# EAGLE schematic modbusbox (EAGLE 9.4.2)
COMPANY: ADAFRUIT INDUSTRIES; DRAWN: KTOWN; REV: B
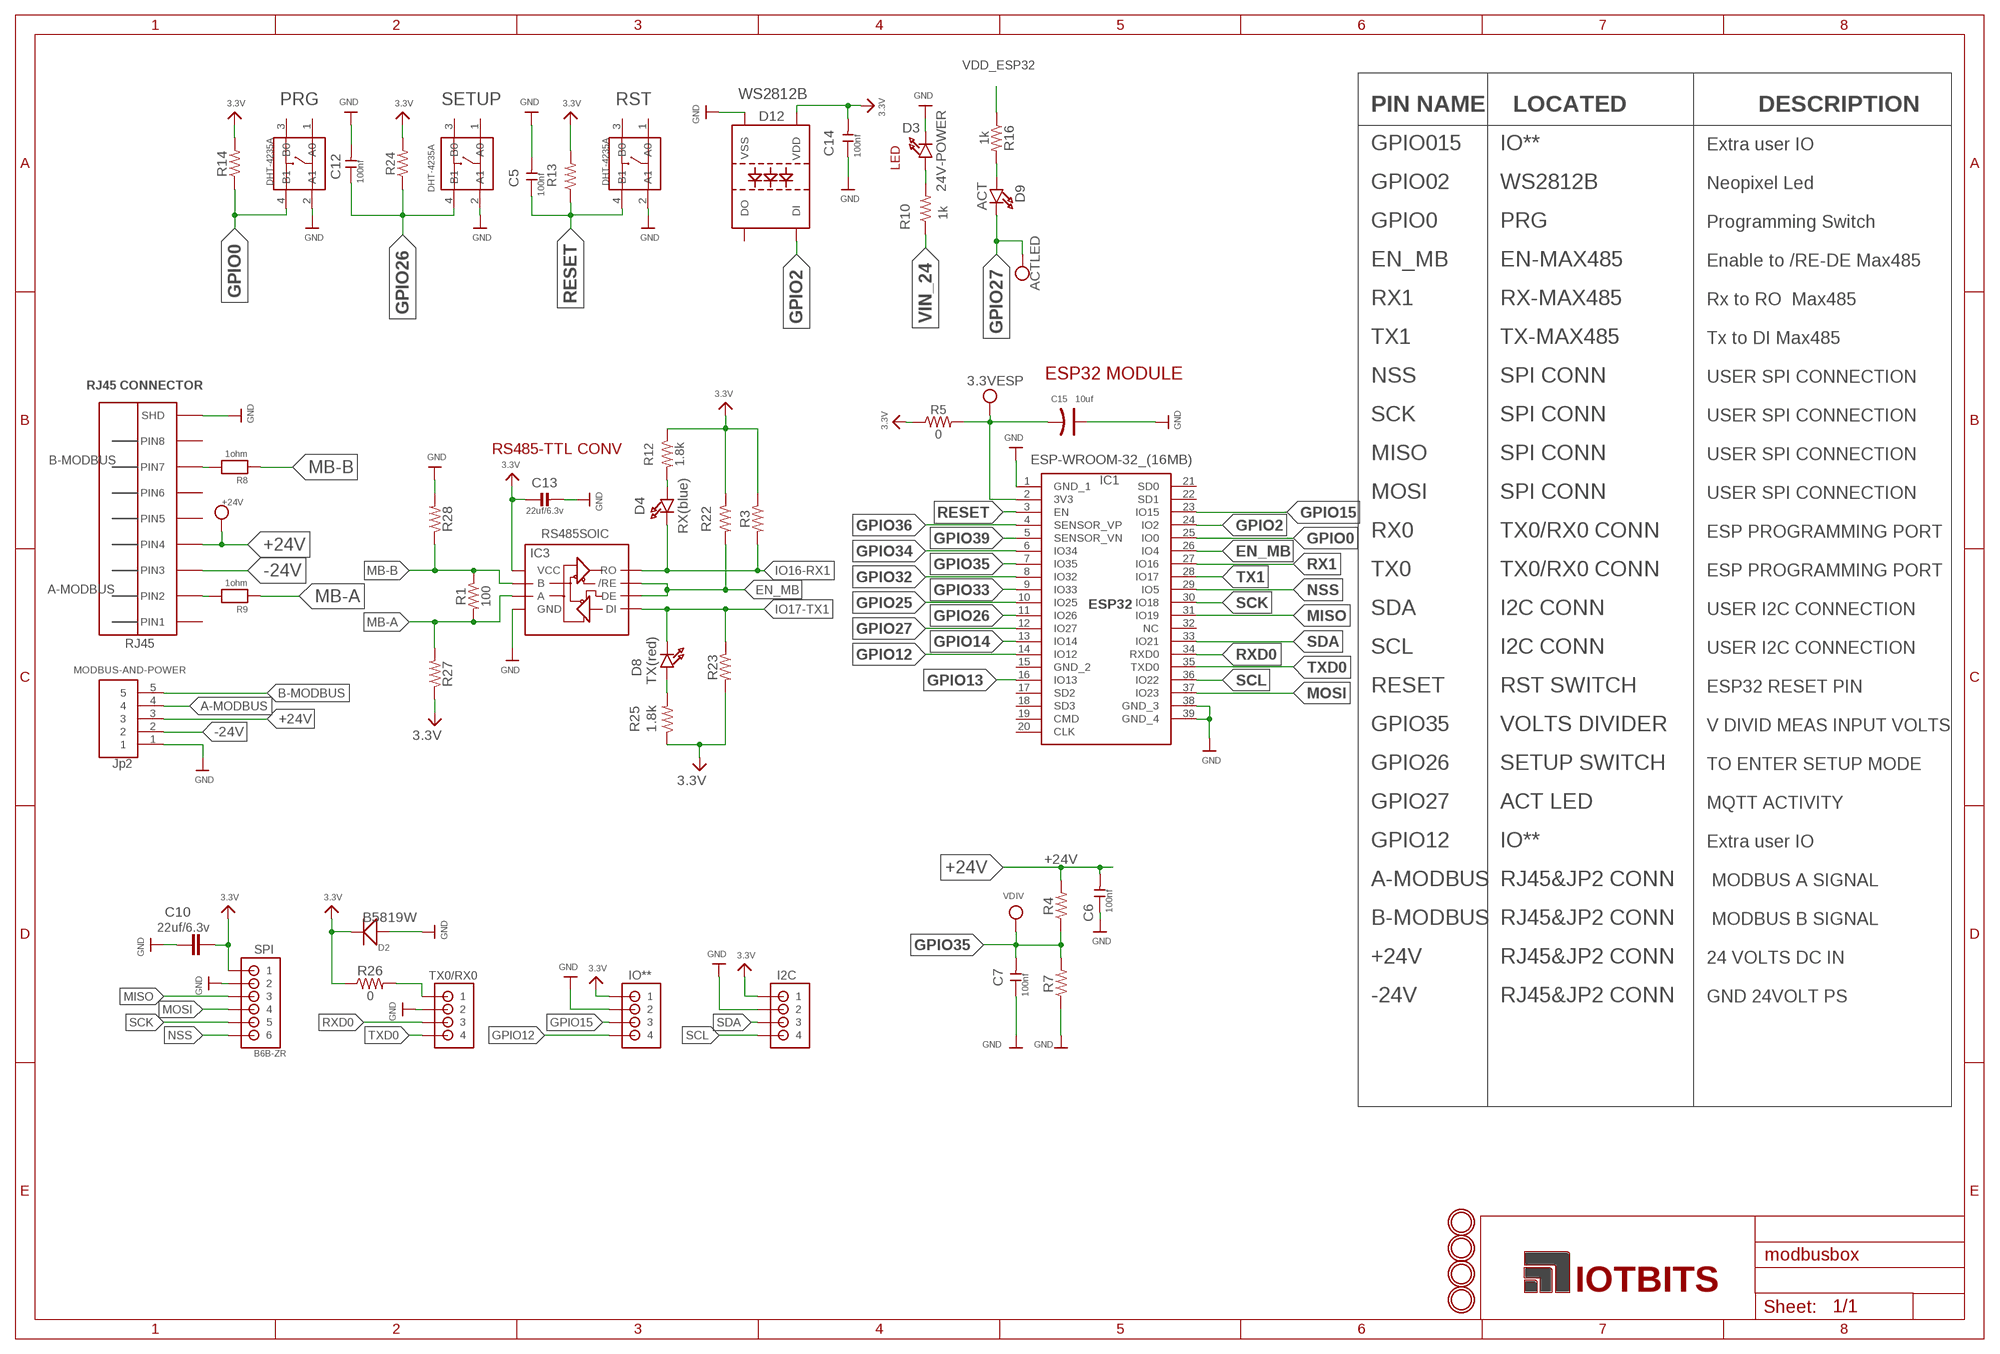
[diagram p0: schematic, sheet 1]

## Parts
3.3VESP  TESTPOINTROUND2MM  [TESTPOINT_ROUND_2MM]
+24V  TESTPOINTROUND2MM  [TESTPOINT_ROUND_2MM]
ACTLED  TESTPOINTROUND2MM  [TESTPOINT_ROUND_2MM]
C5  100nf  CERAMIC-100NF-50V-10%-X7R(0603)  [C0603]
C6  100nf  CERAMIC-100NF-50V-10%-X7R(0603)  [C0603]
C7  100nf  CERAMIC-100NF-50V-10%-X7R(0603)  [C0603]
C10  22uf/6.3v  CAP0805-CAP-LARGEPADS  [0805-CAP-LARGEPADS]
C12  100nf  CERAMIC-100NF-50V-10%-X7R(0603)  [C0603]
C13  22uf/6.3v  CAP_CERAMIC_0805  [_0805]
C14  100nf  CERAMIC-100NF-50V-10%-X7R(0603)  [C0603]
C15  10uf  TANTALUM-SMD-10UF-10V-10%(AVX-A)  [AVX-A]
D2  B5819W  SMD-DIODE-SCHOTTKY-20V-1A(SOD-123)  [SOD-123]
D3  24V-POWER  LED0603  [CHIPLED_0603]
D4  RX(blue)  LED0603  [CHIPLED_0603]
D8  TX(red)  LED0603  [CHIPLED_0603]
D9  ACT  LED0603  [CHIPLED_0603]
D12  WS2812B  [WS2812B]
I2C  B4B-ZR  [B4B-ZR]
IC1  ESP-WROOM-32_(16MB)  [ESP32WROOM32D]
IC3  RS485SOIC  [SO08]
IO**  B4B-ZR  [B4B-ZR]
MODBUS-AND-POWER  5PIN  [B5B-PH-K-S]
PRG  DHT-4235A  SMD-BUTTON-TOP-DHT-4235A(4P-4.2X3.2MM)  [SW4-SMD-4.2X3.2X2.5MM]
R1  100  100OHM-0603-1/4W-5%  [0603]
R3  10KOHM-0603-1/10W-1%  [0603]
R4  100k  10KOHM-0603-1/10W-1%  [0603]
R5  0  0OHM-0603-1/10W-5%  [0603]
R7  15k  10KOHM-0603-1/10W-1%  [0603]
R8  1ohm  RESISTOR0603  [0603]
R9  1ohm  RESISTOR0603  [0603]
R10  1k  1KOHM-0603-1/10W-1%  [0603]
R12  1.8k  1.8KOHM-0603-1/10W-1%  [0603]
R13  10KOHM-0603-1/10W-1%  [0603]
R14  10KOHM-0603-1/10W-1%  [0603]
R16  1k  1KOHM-0603-1/10W-1%  [0603]
R22  10KOHM-0603-1/10W-1%  [0603]
R23  10KOHM-0603-1/10W-1%  [0603]
R24  10KOHM-0603-1/10W-1%  [0603]
R25  1.8k  1.8KOHM-0603-1/10W-1%  [0603]
R26  0  0OHM-0603-1/10W-5%  [0603]
R27  2.2k  10KOHM-0603-1/10W-1%  [0603]
R28  2.2k  10KOHM-0603-1/10W-1%  [0603]
RJ45  RJ45 CONNECTOR  RJ45  [RJ45]
RST  DHT-4235A  SMD-BUTTON-TOP-DHT-4235A(4P-4.2X3.2MM)  [SW4-SMD-4.2X3.2X2.5MM]
SETUP  DHT-4235A  SMD-BUTTON-TOP-DHT-4235A(4P-4.2X3.2MM)  [SW4-SMD-4.2X3.2X2.5MM]
SPI  B6B-ZR  [B6B-ZR]
TX0/RX0  B4B-ZR  [B4B-ZR]
U$30  MOUNTINGHOLE3.0THIN  [MOUNTINGHOLE_3.0_PLATEDTHIN]
U$31  MOUNTINGHOLE3.0THIN  [MOUNTINGHOLE_3.0_PLATEDTHIN]
U$33  MOUNTINGHOLE3.0THIN  [MOUNTINGHOLE_3.0_PLATEDTHIN]
U$35  MOUNTINGHOLE3.0THIN  [MOUNTINGHOLE_3.0_PLATEDTHIN]
VDIV  TESTPOINTROUND2MM  [TESTPOINT_ROUND_2MM]

## Nets
3.3V [32mil]: C10.1 C13.1 C14.2 D2.- D12.1(VDD) I2C.1 IC3.8(VCC) IO**.1 R3.1 R5.1 R12.1 R13.2 R14.2 R22.1 R23.2 R24.2 R25.1 R26.1 R27.1 SPI.1
+24V: +24V.P$1 C6.2 MODBUS-AND-POWER.3 R4.2 RJ45.P$10(PIN4)
-24V: MODBUS-AND-POWER.2 RJ45.P$9(PIN3)
A-MODBUS [12mil]: MODBUS-AND-POWER.4 R9.2 RJ45.P$3(PIN2)
B-MODBUS [12mil]: MODBUS-AND-POWER.5 R8.2 RJ45.P$6(PIN7)
EN_MB: IC1.26(IO4) IC3.2(/RE) IC3.3(DE) R22.2
GND [18mil]: C5.2 C6.1 C7.1 C10.2 C12.2 C13.2 C14.1 C15.+ D2.+ D3.C D12.3(VSS) I2C.2 IC1.1(GND_1) IC1.38(GND_3) IC1.39(GND_4) IC3.5(GND) IO**.2 MODBUS-AND-POWER.1 PRG.2(A1) R7.1 R28.2 RJ45.P$1(SHD) RJ45.P$2(SHD) RST.2(A1) SETUP.2(A1) SPI.2 TX0/RX0.2
GPIO0: IC1.25(IO0) PRG.4(B1) R14.1
GPIO2: D12.4(DI) IC1.24(IO2)
GPIO12: IC1.14(IO12) IO**.4
GPIO13: IC1.16(IO13)
GPIO14: IC1.13(IO14)
GPIO15: IC1.23(IO15) IO**.3
GPIO25: IC1.10(IO25)
GPIO26: C12.1 IC1.11(IO26) R24.1 SETUP.4(B1)
GPIO27: ACTLED.P$1 D9.C IC1.12(IO27)
GPIO32: IC1.8(IO32)
GPIO33: IC1.9(IO33)
GPIO34: IC1.6(IO34)
GPIO35: C7.2 IC1.7(IO35) R4.1 R7.2 VDIV.P$1
GPIO36: IC1.4(SENSOR_VP)
GPIO39: IC1.5(SENSOR_VN)
IO16-RX1: D4.C IC3.1(RO) R3.2
IO17-TX1: D8.C IC3.4(DI) R23.1
MB-A [12mil]: IC3.6(A) R1.2 R9.1 R27.2
MB-B [12mil]: IC3.7(B) R1.1 R8.1 R28.1
MISO: IC1.31(IO19) SPI.3
MOSI: IC1.37(IO23) SPI.4
N$5: D3.A R10.2
N$8: D8.A R25.2
N$14: D9.A R16.2
N$15 [20mil]: R26.2 TX0/RX0.1
N$17: D4.A R12.2
NSS: IC1.29(IO5) SPI.6
RESET: C5.1 IC1.3(EN) R13.1 RST.4(B1)
RX1: IC1.27(IO16)
RXD0: IC1.34(RXD0) TX0/RX0.3
SCK: IC1.30(IO18) SPI.5
SCL: I2C.4 IC1.36(IO22)
SDA: I2C.3 IC1.33(IO21)
TX1: IC1.28(IO17)
TXD0: IC1.35(TXD0) TX0/RX0.4
VDD_ESP32 [32mil]: 3.3VESP.P$1 C15.- IC1.2(3V3) R5.2 R16.1
VIN_24 [14mil]: R10.1
Unconnected: D12.2(DO) IC1.15(GND_2) IC1.17(SD2) IC1.18(SD3) IC1.19(CMD) IC1.20(CLK) IC1.21(SD0) IC1.22(SD1) IC1.32(NC) PRG.1(A0) PRG.3(B0) RJ45.P$4(PIN8) RJ45.P$5(PIN6) RJ45.P$7(PIN5) RJ45.P$8(PIN1) RST.1(A0) RST.3(B0) SETUP.1(A0) SETUP.3(B0)

## Notes on the sheet
- PIN NAME | LOCATED | DESCRIPTION
- GPIO015 | IO** | Extra user IO
- LED
- GPIO02 | WS2812B | Neopixel Led
- GPIO0 | PRG | Programming Switch
- EN_MB | EN-MAX485 | Enable to /RE-DE Max485
- RX1 | RX-MAX485 | Rx to RO  Max485
- TX1 | TX-MAX485 | Tx to DI Max485
- ESP32 MODULE | NSS | SPI CONN | USER SPI CONNECTION
- RJ45 CONNECTOR
- SCK | SPI CONN | USER SPI CONNECTION
- RS485-TTL CONV
- MISO | SPI CONN | USER SPI CONNECTION
- MOSI | SPI CONN | USER SPI CONNECTION
- RX0 | TX0/RX0 CONN | ESP PROGRAMMING PORT
- TX0 | TX0/RX0 CONN | ESP PROGRAMMING PORT
- ESP32
- SDA | I2C CONN | USER I2C CONNECTION
- SCL | I2C CONN | USER I2C CONNECTION
- RESET | RST SWITCH | ESP32 RESET PIN
- GPIO35 | VOLTS DIVIDER | V DIVID MEAS INPUT VOLTS
- Jp2 | GPIO26 | SETUP SWITCH | TO ENTER SETUP MODE
- GPIO27 | ACT LED | MQTT ACTIVITY
- GPIO12 | IO** | Extra user IO
- A-MODBUS | RJ45&JP2 CONN | MODBUS A SIGNAL
- B-MODBUS | RJ45&JP2 CONN | MODBUS B SIGNAL
- +24V | RJ45&JP2 CONN | 24 VOLTS DC IN
- -24V | RJ45&JP2 CONN | GND 24VOLT PS

## Library data of the parts
3.3VESP +24V ACTLED VDIV = microbuilder:TESTPOINT: Test Point Various test points for characterisation and PCB testing TESTPOINT_SMT - Compact Surface Mount Test Point [Digikey: 5016KTR-ND]
C5 C12 = Seeed-Capacitor:CERAMIC-100NF-50V-10%-X7R(0603): 302010138; MPN: CC0603KRX7R9BB104; SPICEPREFIX: C
C6 C7 C14 = Seeed-Capacitor:CERAMIC-100NF-50V-10%-X7R(0603): 302010138; MPN: CC0603KRX7R9BB104
C10 = LoLin32-Lora:CAP: Capacitor Standard 0603 ceramic capacitor, and 0.1" leaded capacitor.
C13 = Adafruit HUZZAH32 ESP32 Feather:CAP_CERAMIC: Ceramic Capacitors For new designs, use the packages preceded by an '_' character since they are more reliable: The following footprints should be used on most boards: _0402 - Standard footprint for regular board layouts _0603 - Standard footprint for regular board layouts _0805 - Standard footprint for regular board layouts _1206 - Standard footprint for regular board layouts For extremely tight-pitch boards where space is at a premium, the following 'micro-pitch' footprints can be used (smaller pads, no silkscreen outline, etc.): _0402MP - Micro-pitch footprint for very dense/compact boards _0603MP - Micro-pitch footprint for very dense/compact boards _0805MP - Micro-pitch footprint for very dense/compact boards _1206MP - Micro-pitch footprint for very dense/compact boards
C15 = Seeed-Capacitor:TANTALUM-SMD-10UF-10V-10%(AVX-A): 302020011; MPN: TAJA106K010RNJ
D2 = Seeed-Diode:SMD-DIODE-SCHOTTKY-20V-1A(SOD-123): 304020034; MPN: B5819W; VALUE: 20V-1A; WEB: https://www.mouser.com/datasheet/2/258/B5817W-B5819W(SOD-123)-276623.pdf
D3 D4 D8 D9 = microbuilder:LED: LED 0603 - 0603 Surface Mount Package 2mA: Green LED - Low Power (3.9mcd, 2ma, 1.7Vf) - Digikey: 475-2709-2-ND Orange LED - Low Power (9.8mcd, 2ma, 1.8Vf) - Digikey: 475-1194-2-ND Red LED - Low Power (5mcd, 2ma, 1.8Vf) - Digikey: 475-1195-2-ND Yellow LED - Low Power (7mcd, 2ma, 1.8Vf) - Digikey: 475-1196-2-ND 5mA: Blue LED - Low Power (17mcd, 5ma, 2.9Vf) - Digikey: LNJ937W8CRACT-ND 0805 - 0805 Surface Mount Package 2mA: Red LED (8.8mcd, 2mA, 1.8Vf, Clear) - Low Power [Digikey: 475-2510-1-ND] Green LED (5mcd, 2mA, 1.8Vf, Clear) - Low Power [Digikey: 475-2730-1-ND] Yellow LED (11.3mcd, 2mA, 1.8Vf, Clear) - Low Power [Digikey: 475-2555-1-ND] 20mA: Red LED (104mcd, 20mA, Diffused) - LS R976 [Digikey: 475-1278-6-ND] Red LED (12mcd, 20mA, 2.0Vf, Clear) - APT2012EC [Digikey: 754-1128-1-ND] Green LED (15mcd, 20mA, 2.2Vf, Clear) - APT2012GC [Digikey: 754-1131-1-ND] Orange LED (160mcd, 20mA, 2.1Vf, Clear) - APT2012SECK [Digikey: 754-1130-1-ND] 1206 - 1206 Surface Mount Package Green LED (26mcd, 20mA, Diffused) - LG N971 [Digikey: 475-1407-6-ND] Red LED (15mcd, 20mA, Diffused) - LH N974 [Digikey: 475-1416-6-ND]
D12 = WS2812:WS2812B
I2C IO** TX0/RX0 = jst:B4B-ZR: JST-ZH Connector 4 pol, 1.5mm pitch Package: B4B-ZR Source: http://www.jst-mfg.com/product/pdf/eng/eZH.pdf
IC1 = SamacSys_Parts:ESP-WROOM-32_(16MB): WiFi Modules (802.11) SMD Module, ESP32-D0WDQ6, 128Mbits SPI flash, UART Mode Source: Datasheet <https://www.mouser.com/datasheet/2/891/esp-wroom-32_datasheet_en-1365813.pdf>; DESCRIPTION: WiFi Modules (802.11) SMD Module, ESP32-D0WDQ6, 128Mbits SPI flash, UART Mode; HEIGHT: 3.1mm; MANUFACTURER_NAME: Espressif; MANUFACTURER_PART_NUMBER: ESP-WROOM-32 (16MB); MOUSER_PART_NUMBER: 356-ESPWROOM3216MB; RS_PART_NUMBER: 356-ESPWROOM3216MB
IC3 = RS485_Breakout_v10:RS485
MODBUS-AND-POWER = jst_eph:5PIN
PRG RST = Seeed-Switch:SMD-BUTTON-TOP-DHT-4235A(4P-4.2X3.2MM): 311020045; MPN: DHT-4235A; SPICEPREFIX: E
R1 = SparkFun-Resistors:100OHM: 100Ω resistor A resistor is a passive two-terminal electrical component that implements electrical resistance as a circuit element. Resistors act to reduce current flow, and, at the same time, act to lower voltage levels within circuits. - Wikipedia; PROD_ID: RES-12438
R3 R4 R7 R22 R23 R27 R28 = SparkFun-Resistors:10KOHM: 200kΩ resistor A resistor is a passive two-terminal electrical component that implements electrical resistance as a circuit element. Resistors act to reduce current flow, and, at the same time, act to lower voltage levels within circuits. - Wikipedia; R0603: 200K
R5 R26 = SparkFun-Resistors:0OHM: 0Ω resistor A resistor is a passive two-terminal electrical component that implements electrical resistance as a circuit element. Resistors act to reduce current flow, and, at the same time, act to lower voltage levels within circuits. - Wikipedia; PROD_ID: RES-08609
R8 R9 = microbuilder:RESISTOR: Resistors 0402 - 0402 Surface Mount Package 22 Ohm 1% 1/16W [Digikey: 311-22.0LRTR-ND] 33 Ohm 5% 1/16W 1.0K 5% 1/16W 1.5K 5% 1/16W 2.0K 1% 1/16W 10.0K 1% 1/16W [Digikey: 311-10.0KLRTR-ND] 10.0K 5% 1/16W [Digikey: RMCF0402JT10K0TR-ND] 12.1K 1% 1/16W [Digikey: 311-22.0LRTR-ND] 100.0K 5% 1/16W 0603 - 0603 Surface Mount Package 0 Ohm 1/10 Watt 1% Resistor 15 Ohm 1/10 Watt 1% Resistor 33 Ohm 1/10 Watt 1% Resistor 49.9 Ohm 1/10 Watt 1% Resistor 100 Ohm 1/10 Watt 1% Resistor 150 Ohm 1/10 Watt 1% Resistor 240 Ohm 1/10 Watt 1% Resistor 390 Ohm 1/10 Watt 1% Resistor 560 Ohm 1/10 Watt 1% Resistor 680 Ohm 1/10 Watt 1% Resistor 750 Ohm 1/10 Watt 1% Resistor 1.0K Ohm 1/10 Watt 1% Resistor 1.5K Ohm 1/10 Watt 1% Resistor 2.0K Ohm 1/10 Watt 1% Resistor 2.2K Ohm 1/10 Watt 1% Resistor 3.3K Ohm 1/10 Watt 1% Resistor 4.7K Ohm 1/10 Watt 1% Resistor 10.0K Ohm 1/10 Watt 1% Resistor 12.0K Ohm 1/10 Watt 1% Resistor 12.1K Ohm 1/10 Watt 1% Resistor 20.0K Ohm 1/10 Watt 1% Resistor 33.0K Ohm 1/10 Watt 1% Resistor 100.0K Ohm 1/10 Watt 1% Resistor 0805 - 0805 Surface Mount Package 0 Ohm 1/8 Watt 1% Resistor 33 Ohm 1/8 Watt 1% Resistor 100 Ohm 1/8 Watt 1% Resistor 150 Ohm 1/8 Watt 1% Resistor 200 Ohm 1/8 Watt 1% Resistor 240 Ohm 1/8 Watt 1% Resistor 330 Ohm 1/8 Watt 1% Resistor 390 Ohm 1/8 Watt 1% Resistor 470 Ohm 1/8 Watt 1% Resistor 1.0K Ohm 1/8 Watt 1% Resistor 1.5K Ohm 1/8 Watt 1% Resistor 2.0K Ohm 1/8 Watt 1% Resistor 4.7K Ohm 1/8 Watt 1% Resistor 5.1K Ohm 1/8 Watt 1% Resistor 5.6K Ohm 1/8 Watt 1% Resistor 10.0K Ohm 1/8 Watt 1% Resistor 22.0K Ohm 1/8 Watt 1% Resistor 33.0K Ohm 1/8 Watt 1% Resistor 100K Ohm 1/8 Watt 1% Resistor 1206 - 1206 Surface Mount Package 2012 - 2010 Surface Mount Package 0.11 Ohm 1/2 Watt 1% Resistor - Digikey: RHM.11UCT-ND
R10 R16 = SparkFun-Resistors:1KOHM: 1kΩ resistor A resistor is a passive two-terminal electrical component that implements electrical resistance as a circuit element. Resistors act to reduce current flow, and, at the same time, act to lower voltage levels within circuits. - Wikipedia; PROD_ID: RES-07856
R12 R25 = SparkFun-Resistors:1.8KOHM: 1.8kΩ resistor A resistor is a passive two-terminal electrical component that implements electrical resistance as a circuit element. Resistors act to reduce current flow, and, at the same time, act to lower voltage levels within circuits. - Wikipedia; PROD_ID: RES-09119
R13 R14 R24 = SparkFun-Resistors:10KOHM: 200kΩ resistor A resistor is a passive two-terminal electrical component that implements electrical resistance as a circuit element. Resistors act to reduce current flow, and, at the same time, act to lower voltage levels within circuits. - Wikipedia; R0603: 200K; SPICEPREFIX: R
RJ45 = RJ45 Jack:RJ45
SETUP = Seeed-Switch:SMD-BUTTON-TOP-DHT-4235A(4P-4.2X3.2MM): 311020045; MPN: DHT-4235A; SPICEPREFIX: S
SPI = jst:B6B-ZR: JST-ZH Connector 6 pol, 1.5mm pitch Package: B6B-ZR Source: http://www.jst-mfg.com/product/pdf/eng/eZH.pdf
U$30 U$31 U$33 U$35 = microbuilder:MOUNTINGHOLE: Mounting Hole For #2 screws (0.086"/2.18mm width, 0.094"/2.4mm hole) use 2.5mm

## Net classes
0 default: width 0.254 mm
1 VBUS: width 0.406 mm
2 3.3V: width 0.508 mm
3 VIN_24: width 0.356 mm
4 +24V: width 0.356 mm
5 GND: width 0.406 mm
6 20mil: width 0.508 mm
7 12mil: width 0.305 mm
8 16mil: width 0.406 mm
9 18mil: width 0.457 mm
10 24mil: width 0.61 mm
11 32mil: width 0.813 mm
12 38mil: width 0.965 mm
13 14mil: width 0.356 mm